# EAGLE design Seguidor (EAGLE 7.6.0)
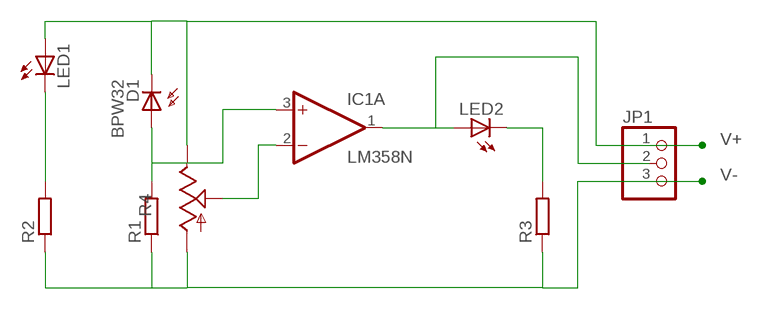
[diagram p0: schematic, sheet 1]

## Parts
D1  BPW32  [BPW32]
IC1  LM358N  [DIL08]
JP1  PINHD-1X3  [1X03]
LED1  LED3MM  [LED3MM]
LED2  LED3MM  [LED3MM]
R1  R-EU_0207/12  [0207/12]
R2  R-EU_0207/12  [0207/12]
R3  R-EU_0207/12  [0207/12]
R4  TRIM_US-B25P  [B25P]

## Nets
N$1: D1.A IC1.3(A:+IN) R1.2
N$2: LED1.K(C) R2.2
N$3: IC1.1(A:OUT) JP1.2 LED2.A
N$4: IC1.2(A:-IN) R4.S
N$5: LED2.K(C) R3.2
V+: D1.K(C) JP1.1 LED1.A R4.E
V-: JP1.3 R1.1 R2.1 R3.1 R4.A
Unconnected: IC1.5(B:+IN) IC1.6(B:-IN) IC1.7(B:OUT)

## Power pins joined to a net without a drawn wire
V+: IC1.8(P:V+)
V-: IC1.4(P:V-)

## Library data of the parts
D1 = opto-trans-siemens:BPW32: PHOTO DIODE; OC_FARNELL: unknown; OC_NEWARK: unknown
IC1 = linear:LM358: OP AMP also LM158; LM258; LM2904 Source: http://cache.national.com/ds/LM/LM158.pdf
JP1 = pinhead:PINHD-1X3: PIN HEADER
LED1 LED2 = led:LED: LED OSRAM: - CHIPLED LG R971, LG N971, LY N971, LG Q971, LY Q971, LO R971, LY R971 LH N974, LH R974 LS Q976, LO Q976, LY Q976 LO Q996 - Hyper CHIPLED LW Q18S LB Q993, LB Q99A, LB R99A - SideLED LS A670, LO A670, LY A670, LG A670, LP A670 LB A673, LV A673, LT A673, LW A673 LH A674 LY A675 LS A676, LA A676, LO A676, LY A676, LW A676 LS A679, LY A679, LG A679 - Hyper Micro SIDELED® LS Y876, LA Y876, LO Y876, LY Y876 LT Y87S - SmartLED LW L88C, LW L88S LB L89C, LB L89S, LG L890 LS L89K, LO L89K, LY L89K LS L896, LA L896, LO L896, LY L896 - TOPLED LS T670, LO T670, LY T670, LG T670, LP T670 LSG T670, LSP T670, LSY T670, LOP T670, LYG T670 LG T671, LOG T671, LSG T671 LB T673, LV T673, LT T673, LW T673 LH T674 LS T676, LA T676, LO T676, LY T676, LB T676, LH T676, LSB T676, LW T676 LB T67C, LV T67C, LT T67C, LS T67K, LO T67K, LY T67K, LW E67C LS E67B, LA E67B, LO E67B, LY E67B, LB E67C, LV E67C, LT E67C LW T67C LS T679, LY T679, LG T679 LS T770, LO T770, LY T770, LG T770, LP T770 LB T773, LV T773, LT T773, LW T773 LH T774 LS E675, LA E675, LY E675, LS T675 LS T776, LA T776, LO T776, LY T776, LB T776 LHGB T686 LT T68C, LB T68C - Hyper Mini TOPLED® LB M676 - Mini TOPLED Santana® LG M470 LS M47K, LO M47K, LY M47K Source: http://www.osram.convergy.de LUXEON: - LUMILED® LXK2-PW12-R00, LXK2-PW12-S00, LXK2-PW14-U00, LXK2-PW14-V00 LXK2-PM12-R00, LXK2-PM12-S00, LXK2-PM14-U00 LXK2-PE12-Q00, LXK2-PE12-R00, LXK2-PE12-S00, LXK2-PE14-T00, LXK2-PE14-U00 LXK2-PB12-K00, LXK2-PB12-L00, LXK2-PB12-M00, LXK2-PB14-N00, LXK2-PB14-P00, LXK2-PB14-Q00 LXK2-PR12-L00, LXK2-PR12-M00, LXK2-PR14-Q00, LXK2-PR14-R00 LXK2-PD12-Q00, LXK2-PD12-R00, LXK2-PD12-S00 LXK2-PH12-R00, LXK2-PH12-S00 LXK2-PL12-P00, LXK2-PL12-Q00, LXK2-PL12-R00 Source: www.luxeon.com KINGBRIGHT: KA-3528ASYC Source: www.kingbright.com
R1-R3 = resistor:R-EU_: RESISTOR, European symbol
R4 = pot:TRIM_US-: POTENTIOMETER

## Board
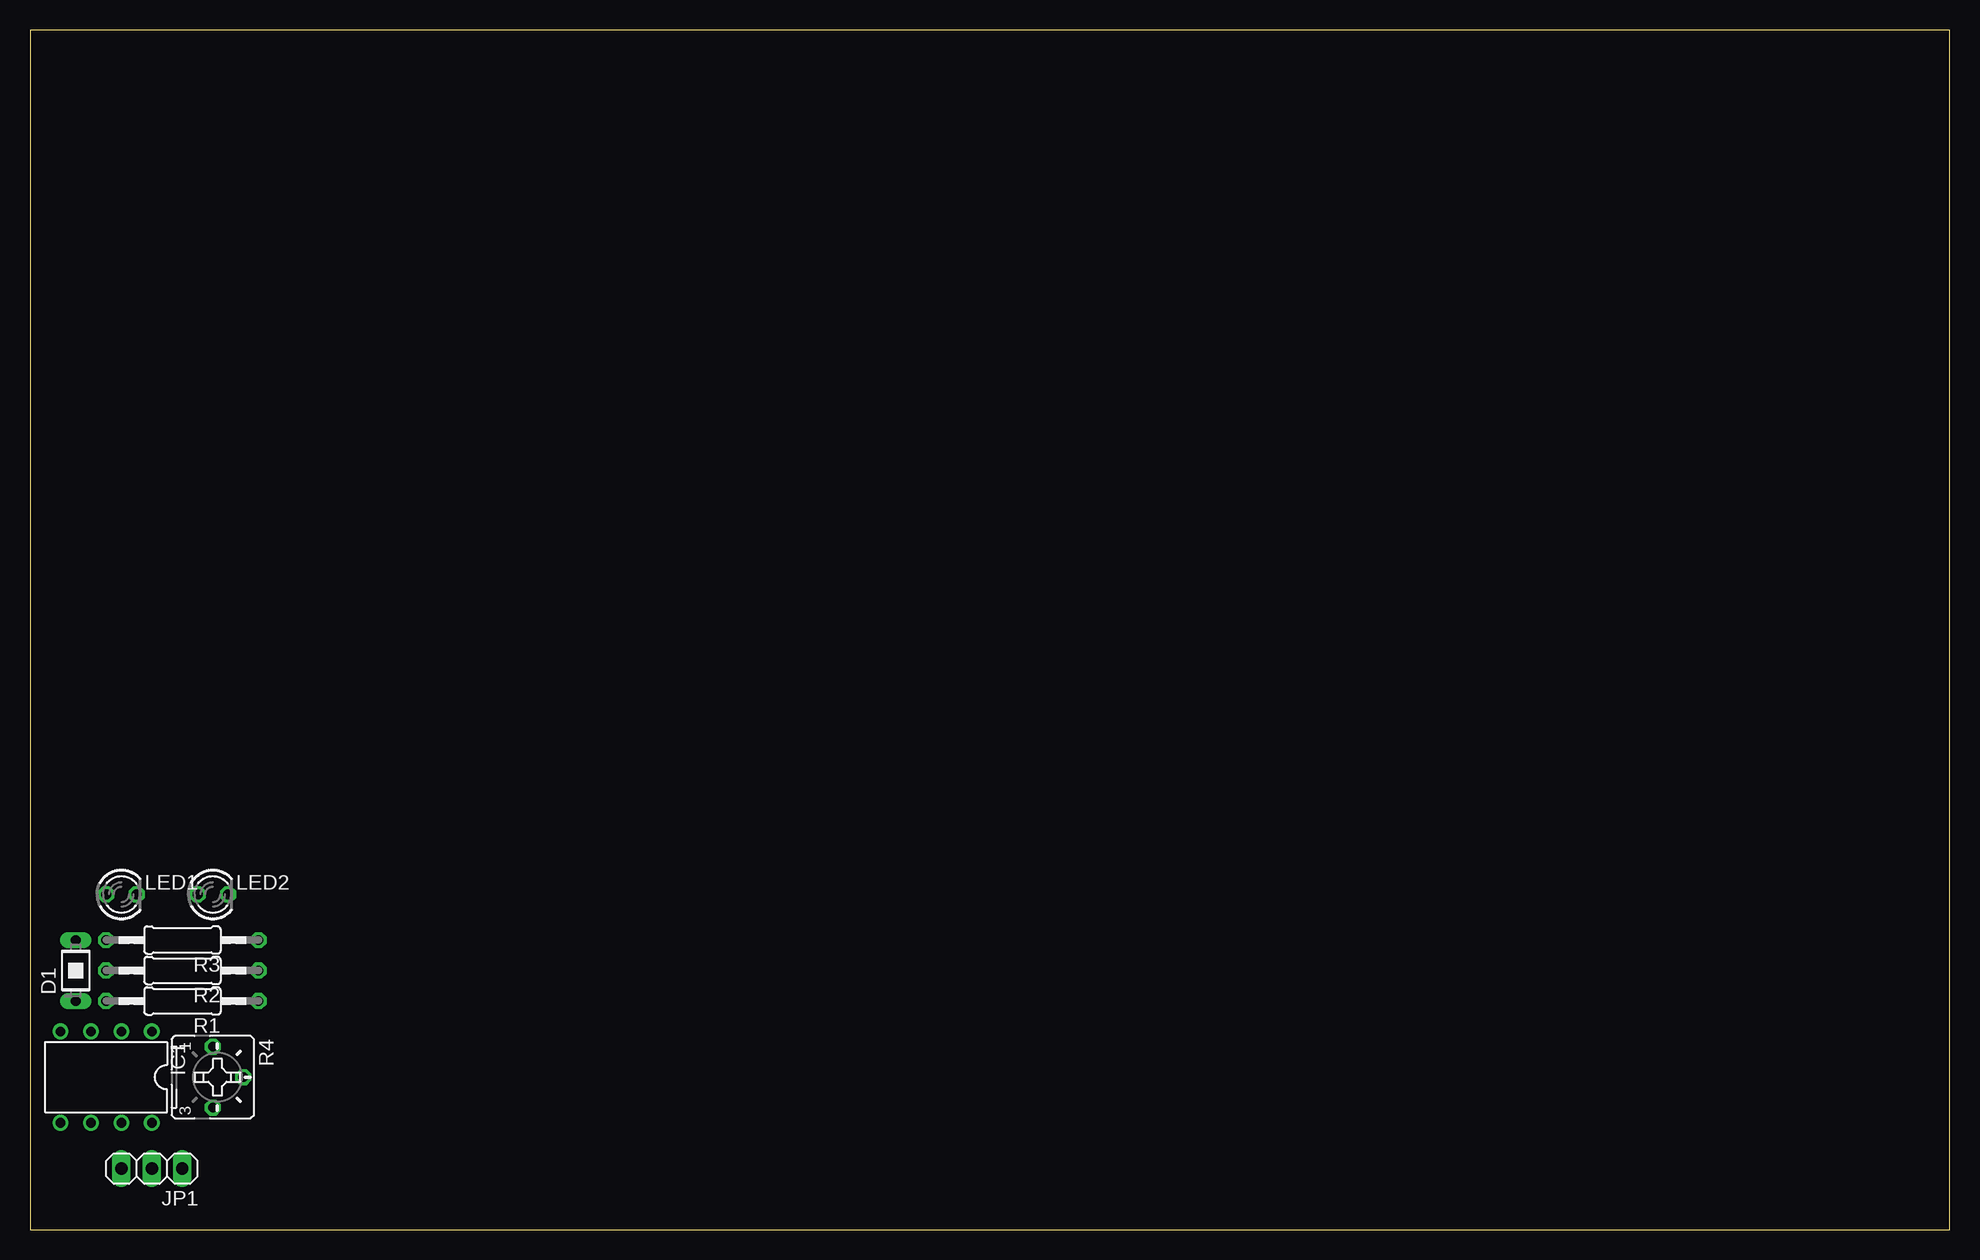
[diagram p1: board, top side]
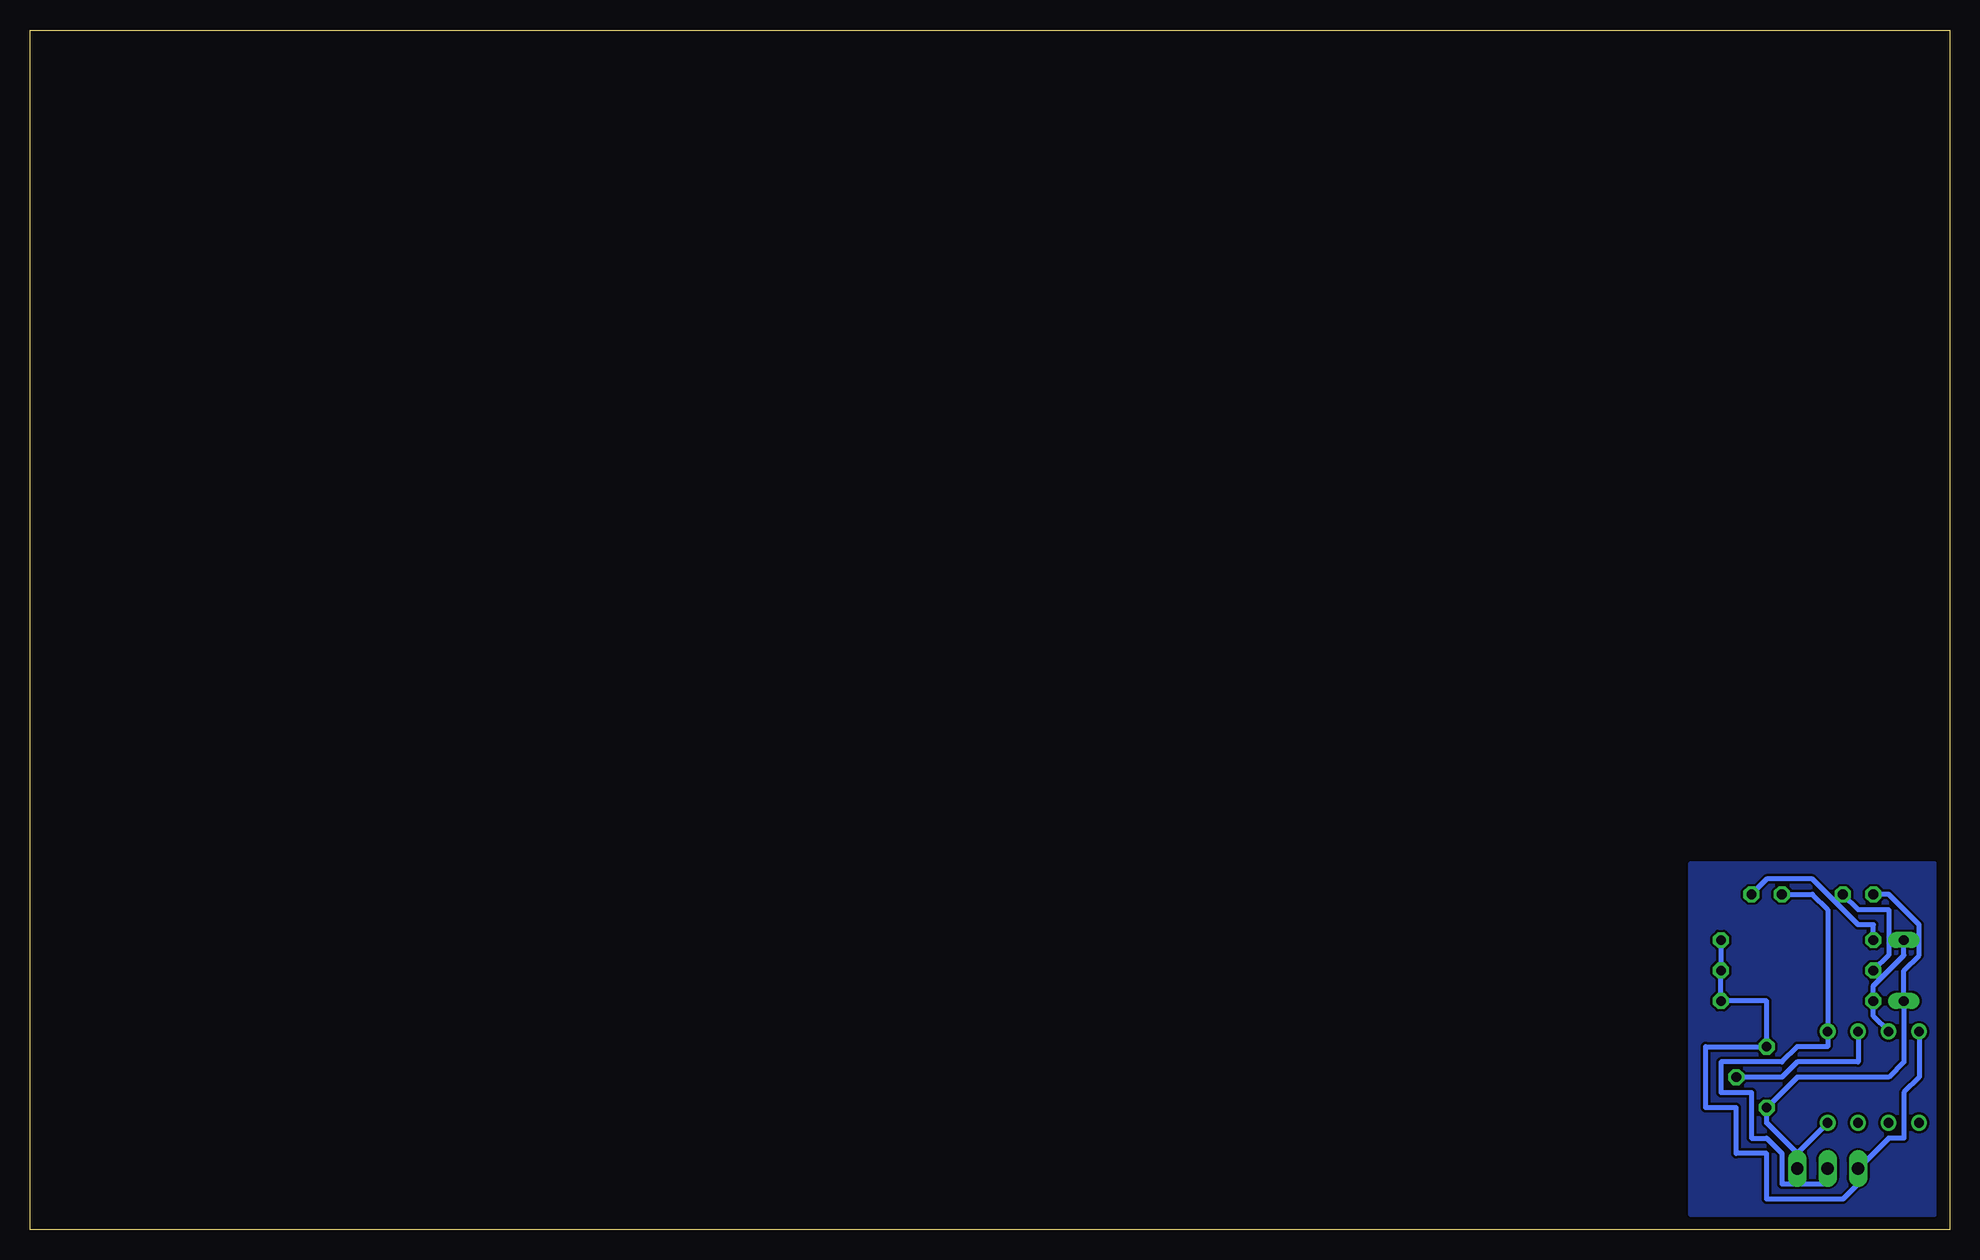
[diagram p2: board, bottom side, seen from below]

Size 160 x 100 mm. Coordinates in mm from the lower left corner, seen from the top.
Outline: 0,0 160,0 160,100 0,100 0,0
Copper layers (1*16): Top 0.035mm / dielectric 1.5mm / Bottom 0.035mm
Design rules "default": minimum track width 10mil, minimum drill 24mil, track to track 8mil, track to pad 8mil, pad to pad 8mil, via to via 8mil, smd to smd 8mil, copper to edge 40mil, drill to drill 8mil, minimum pad ring 10mil, minimum via ring 8mil, stop-mask expansion 4mil, vias tented up to drill 0mil, thermal gap 10mil

### Footprints (pad centres in the part's own frame; a part is rotated, then mirrored left to right if it is on the bottom)
BPW32 = drill 0.813 long: A 0,2.54; K 0,-2.54
DIL08 = drill 0.813 pad 1.27: 1 -3.81,-3.81; 2 -1.27,-3.81; 3 1.27,-3.81; 4 3.81,-3.81; 5 3.81,3.81; 6 1.27,3.81; 7 -1.27,3.81; 8 -3.81,3.81
1X03 = drill 1.016 long: 1 -2.54,0; 2 0,0; 3 2.54,0
LED3MM = drill 0.813 octagon: A -1.27,0; K 1.27,0
0207/12 = drill 0.813 octagon: 1 -6.35,0; 2 6.35,0
B25P = drill 0.813 octagon: A -2.54,0; E 2.54,0; S 0,2.54

### Placement (x,y rotation side)
D1  3.81,21.59 0 top
IC1  6.35,12.7 180 top
JP1  10.16,5.08 180 top
LED1  7.62,27.94 0 top
LED2  15.24,27.94 0 top
R1  12.7,19.05 180 top
R2  12.7,21.59 180 top
R3  12.7,24.13 180 top
R4  15.24,12.7 270 top

### Tracks (layer width: path | path; a pad name or v marks a point on that pad's centre or on a via)
N$1
  Bottom 0.406: IC1.3 6.35,17.78 R1.2 6.35,20.32 3.81,22.86 D1.A
N$2
  Bottom 0.406: LED1.K 7.62,26.67 5.08,26.67 5.08,22.86 R2.2
N$3
  Bottom 0.406: LED2.A 11.43,27.94 10.16,26.67 IC1.1 10.16,15.24 12.7,15.24 13.97,13.97 19.05,13.97 19.05,11.43 16.51,11.43 16.51,7.62 15.24,7.62 13.97,6.35 13.97,3.81 10.16,3.81 JP1.2
N$4
  Bottom 0.406: IC1.2 7.62,13.97 12.7,13.97 13.97,12.7 R4.S
N$5
  Bottom 0.406: R3.2 6.35,25.4 7.62,25.4 11.43,29.21 15.24,29.21 LED2.K
N$8
  pour Bottom: 21.59,30.48 21.59,1.27 1.27,1.27 1.27,30.48
V+
  Bottom 0.406: 12.7,6.35 15.24,8.89 R4.E 12.7,12.7 5.08,12.7 3.81,13.97 D1.K 3.81,21.59 2.54,22.86 2.54,25.4 5.08,27.94 LED1.A | IC1.8 12.7,6.35 | 12.7,6.35 JP1.1
V-
  Bottom 0.406: R3.1 R2.1 R1.1 15.24,19.05 R4.A 20.32,15.24 20.32,10.16 17.78,10.16 17.78,6.35 15.24,6.35 15.24,2.54 8.89,2.54 7.62,3.81 JP1.3 5.08,7.62 3.81,7.62 3.81,11.43 2.54,12.7 IC1.4